# EAGLE design pci-e_x1-breakout (EAGLE 6.6.0)
CNAME: http://ch.ege.io; CREVISION: 1.0; DESIGNER: Christian Ege
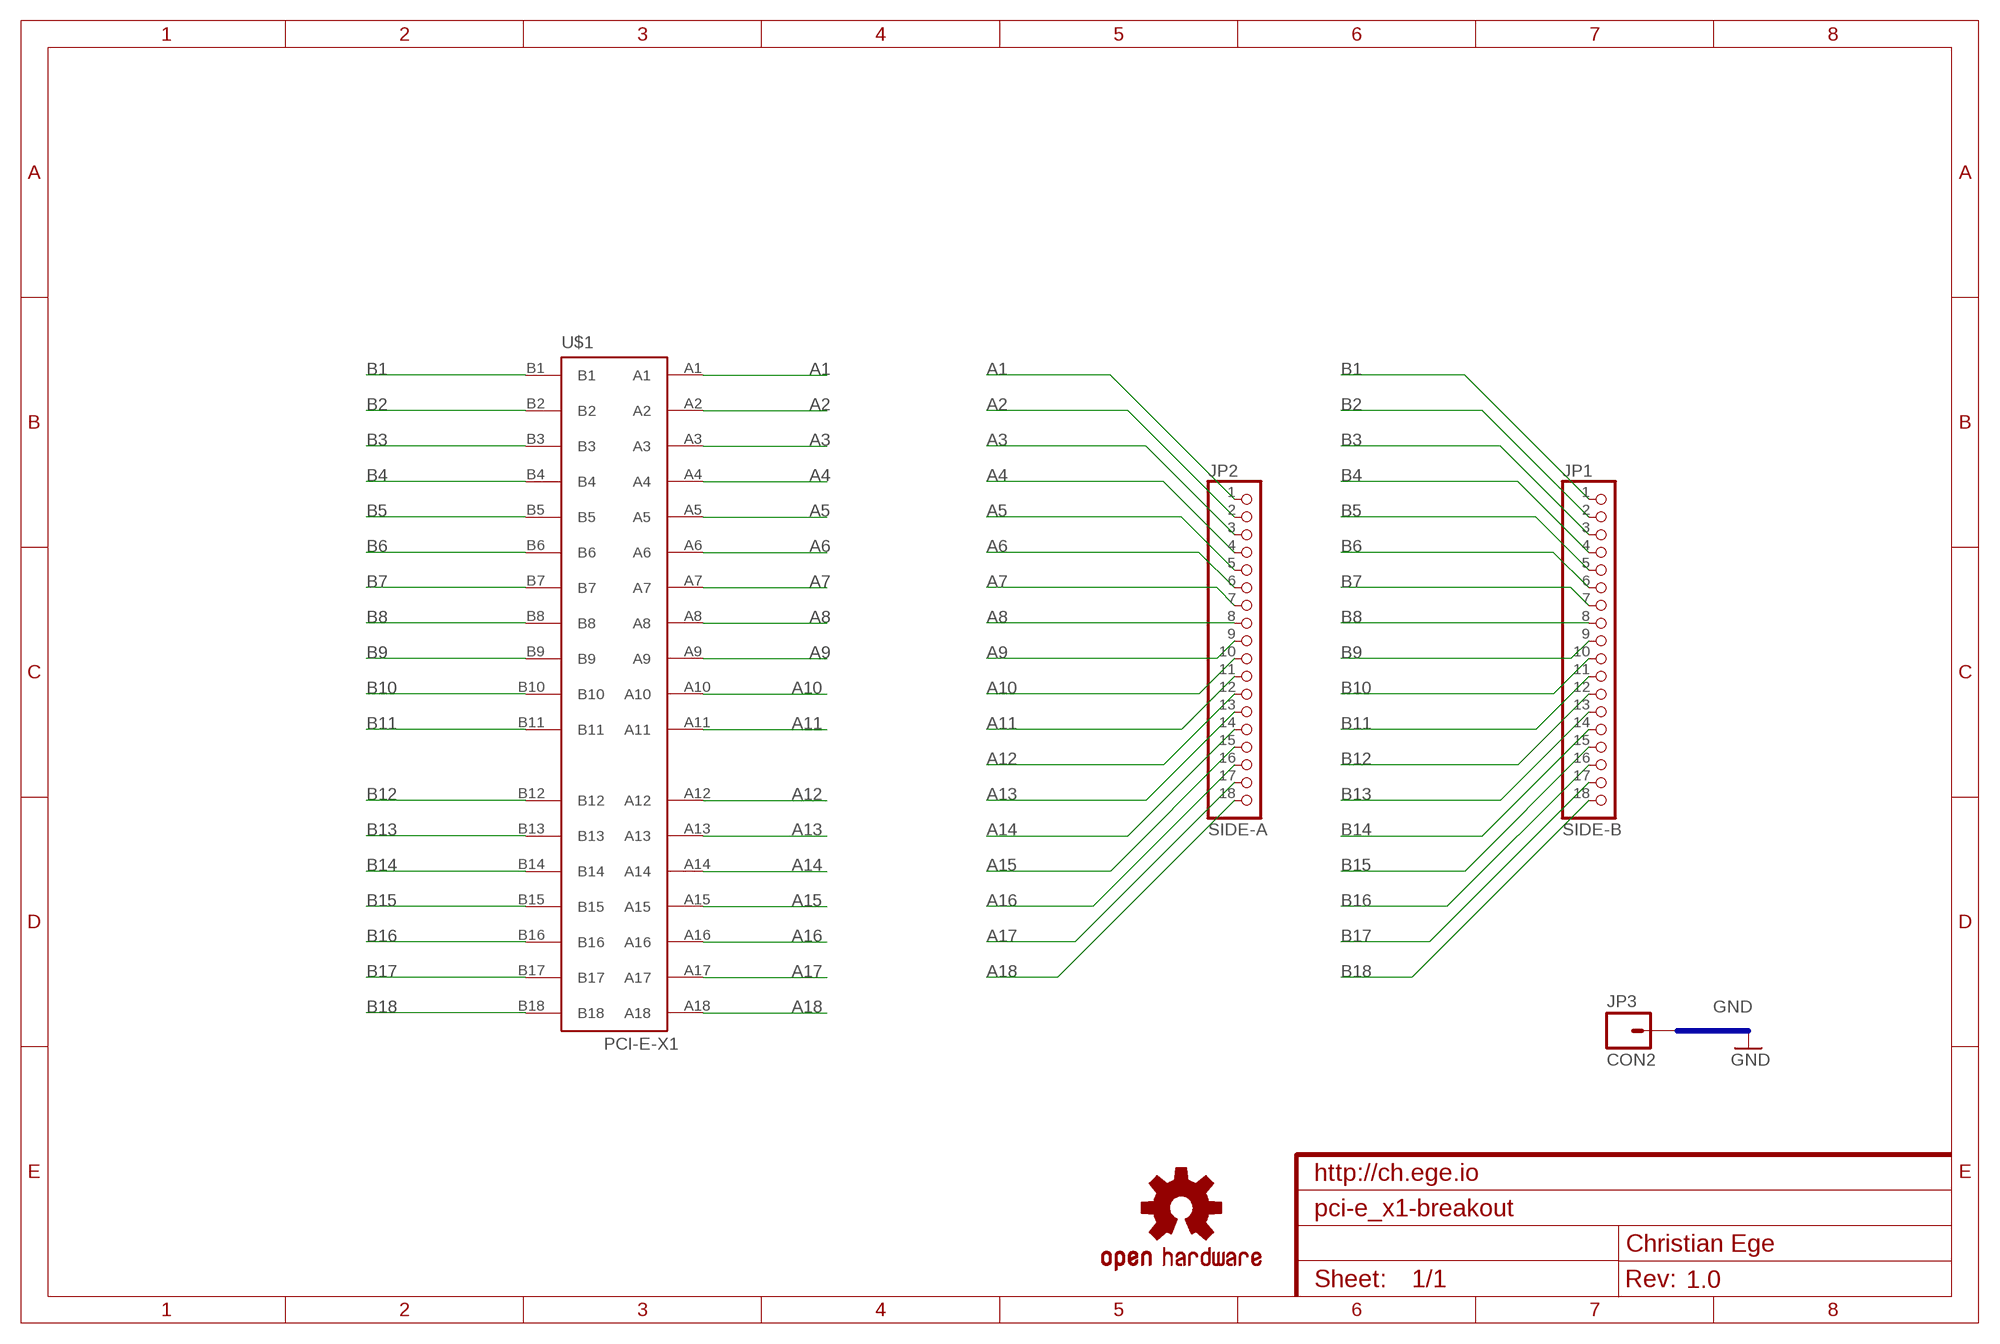
[diagram p0: schematic, sheet 1]

## Parts
JP1  SIDE-B  PINHD-1X18  [1X18]
JP2  SIDE-A  PINHD-1X18  [1X18]
JP3  CON2  M01PTH  [1X01]
LOGO1  OSHW-LOGOS  [OSHW-LOGO-S]
U$1  PCI-E-X1  [PCI-E-X1]

## Nets
A1: JP2.1 U$1.A1
A2: JP2.2 U$1.A2
A3: JP2.3 U$1.A3
A4: JP2.4 U$1.A4
A5: JP2.5 U$1.A5
A6: JP2.6 U$1.A6
A7: JP2.7 U$1.A7
A8: JP2.8 U$1.A8
A9: JP2.9 U$1.A9
A10: JP2.10 U$1.A10
A11: JP2.11 U$1.A11
A12: JP2.12 U$1.A12
A13: JP2.13 U$1.A13
A14: JP2.14 U$1.A14
A15: JP2.15 U$1.A15
A16: JP2.16 U$1.A16
A17: JP2.17 U$1.A17
A18: JP2.18 U$1.A18
B1: JP1.1 U$1.B1
B2: JP1.2 U$1.B2
B3: JP1.3 U$1.B3
B4: JP1.4 U$1.B4
B5: JP1.5 U$1.B5
B6: JP1.6 U$1.B6
B7: JP1.7 U$1.B7
B8: JP1.8 U$1.B8
B9: JP1.9 U$1.B9
B10: JP1.10 U$1.B10
B11: JP1.11 U$1.B11
B12: JP1.12 U$1.B12
B13: JP1.13 U$1.B13
B14: JP1.14 U$1.B14
B15: JP1.15 U$1.B15
B16: JP1.16 U$1.B16
B17: JP1.17 U$1.B17
B18: JP1.18 U$1.B18
Unconnected: JP3.1

## Buses
GND

## Library data of the parts
JP1 JP2 = pinhead:PINHD-1X18: PIN HEADER
JP3 = SparkFun-Connectors:M01: Header 1 Standard 1-pin 0.1" header. Use with straight break away headers (SKU : PRT-00116), right angle break away headers (PRT-00553), swiss pins (PRT-00743), machine pins (PRT-00117), and female headers (PRT-00115).
LOGO1 = SparkFun-Aesthetics:OSHW-LOGO: Open Source Hardware Logo This logo indicates the piece of hardware it is found on incorporates a OSHW license and/or adheres to the definition of open source hardware found here: http://freedomdefined.org/OSHW
U$1 = pci-e_x1:PCI-E-X1

## Board
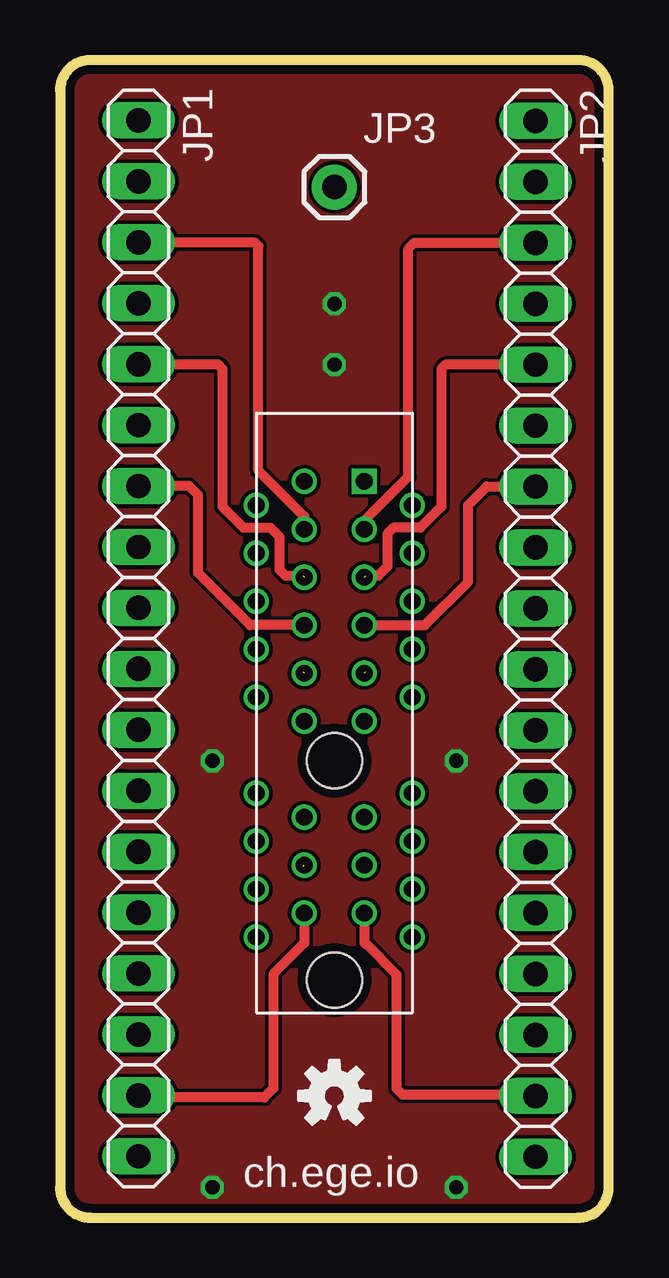
[diagram p1: board, top side]
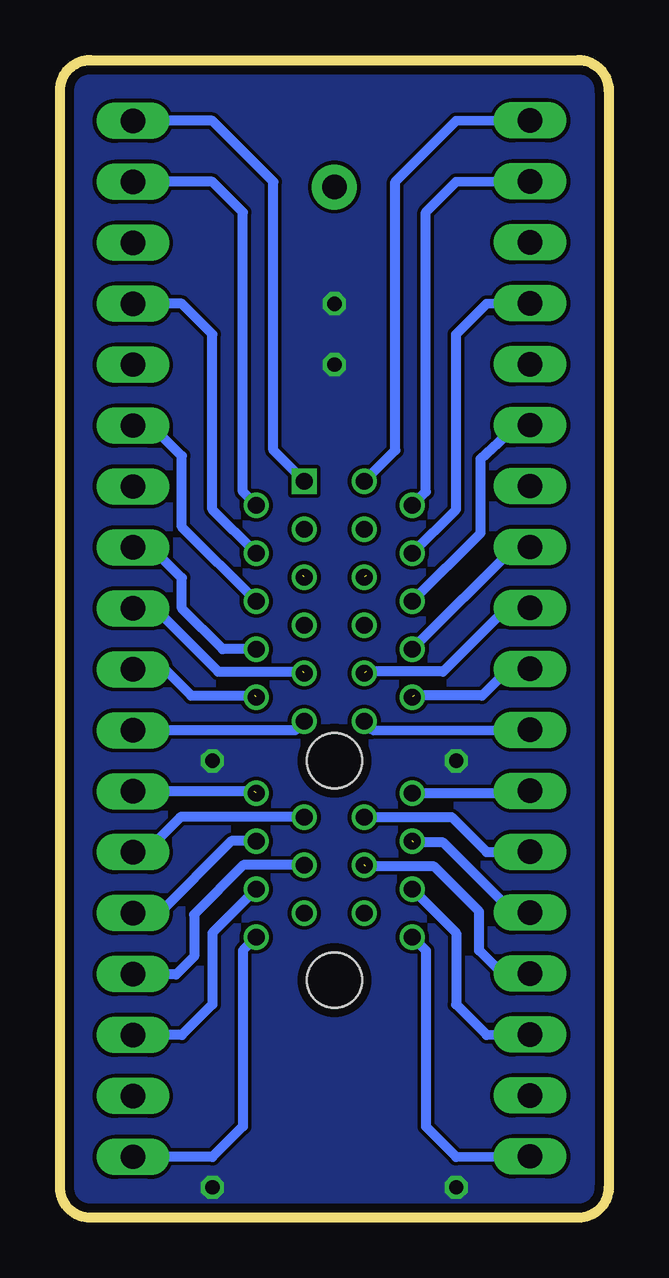
[diagram p2: board, bottom side, seen from below]

Size 22.86 x 48.26 mm. Coordinates in mm from the lower left corner, seen from the top.
Outline: 0,46.99 0,1.27 arc90 1.27,0 21.59,0 arc90 22.86,1.27 22.86,46.99 arc90 21.59,48.26 1.27,48.26 arc90 0,46.99
Copper layers (1*16): Top 0.0356mm / dielectric 1.5011mm / Bottom 0.0356mm
Design rules "OSHPark_LaenPCBOrder": minimum track width 6mil, minimum drill 13mil, track to track 6mil, track to pad 6mil, pad to pad 6mil, via to via 6mil, smd to smd 6mil, copper to edge 15mil, drill to drill 6mil, minimum pad ring 7mil, minimum via ring 7mil, stop-mask expansion 3mil, vias tented up to drill 0mil, thermal gap 10mil

### Footprints (pad centres in the part's own frame; a part is rotated, then mirrored left to right if it is on the bottom)
1X18 = drill 1.016 long: 1 -21.59,0; 2 -19.05,0; 3 -16.51,0; 4 -13.97,0; 5 -11.43,0; 6 -8.89,0; 7 -6.35,0; 8 -3.81,0; 9 -1.27,0; 10 1.27,0; 11 3.81,0; 12 6.35,0; 13 8.89,0; 14 11.43,0; 15 13.97,0; 16 16.51,0; 17 19.05,0; 18 21.59,0
1X01 = drill 1.016 pad 1.88: 1 0,0
PCI-E-X1 = drill 0.7 square: A1 1.25,11.65 | drill 0.7: A2 3.25,10.65; A3 1.25,9.65; A4 3.25,8.65; A5 1.25,7.65; A6 3.25,6.65; A7 1.25,5.65; A8 3.25,4.65; A9 1.25,3.65; A10 3.25,2.65; A11 1.25,1.65; A12 3.25,-1.35; A13 1.25,-2.35; A14 3.25,-3.35; A15 1.25,-4.35; A16 3.25,-5.35; A17 1.25,-6.35; A18 3.25,-7.35; B1 -1.25,11.65; B2 -3.25,10.65; B3 -1.25,9.65; B4 -3.25,8.65; B5 -1.25,7.65; B6 -3.25,6.65; B7 -1.25,5.65; B8 -3.25,4.65; B9 -1.25,3.65; B10 -3.25,2.65; B11 -1.25,1.65; B12 -3.25,-1.35; B13 -1.25,-2.35; B14 -3.25,-3.35; B15 -1.25,-4.35; B16 -3.25,-5.35; B17 -1.25,-6.35; B18 -3.25,-7.35 | hole 2.3: 0,0; 0,-9.15

### Placement (x,y rotation side)
JP1  3.27,24.15 270 top
JP2  19.82,24.13 270 top
JP3  11.43,42.97 0 top
LOGO1  11.43,5.08 0 top
U$1  11.43,19.05 0 top

### Tracks (layer width: path | path; a pad name or v marks a point on that pad's centre or on a via)
A1
  Bottom 0.406: JP2.1 16.51,45.72 13.97,43.18 13.97,31.99 U$1.A1
A2
  Bottom 0.406: JP2.2 16.51,43.18 15.24,41.91 15.24,30.26 U$1.A2
A3
  Top 0.406: JP2.3 14.77,40.65 14.52,40.4 14.52,30.89 12.77,29.14 12.68,29.05 U$1.A3
A4
  Bottom 0.406: JP2.4 17.78,38.1 16.51,36.83 16.51,29.53 U$1.A4
A5  (1 unrouted)
  Top 0.406: JP2.5 16.06,35.56 15.89,35.4 15.89,29.64 15.02,28.77 13.89,28.77 13.64,28.52 13.64,27.14 13.27,26.77 12.75,26.77
A6
  Bottom 0.406: JP2.6 19.05,33.02 17.78,31.75 17.78,28.8 U$1.A6
A7
  Top 0.406: U$1.A7 15.2,24.7 17,26.5 17,29.7 17.78,30.48 JP2.7
A8
  Bottom 0.406: U$1.A8 16.08,23.7 17.78,25.4 17.78,26.67 19.05,27.94 JP2.8
A9  (1 unrouted)
  Bottom 0.406: JP2.9 18.9,25.4 16.27,22.77 12.75,22.77
A10  (1 unrouted)
  Bottom 0.406: JP2.10 18.55,22.86 18.52,22.89 17.39,21.77 14.75,21.77
A11
  Bottom 0.406: JP2.11 13.06,20.32 U$1.A11
A12  (1 unrouted)
  Bottom 0.406: 14.76,17.78 JP2.12
A13
  Bottom 0.406: JP2.13 20.29,15.27 19.27,15.27 17.91,16.64 17.84,16.7 U$1.A13
A14
  Bottom 0.406: JP2.14 19.77,12.64 18.77,12.64 15.71,15.7 U$1.A14
A15
  Bottom 0.406: JP2.15 19.8,10.14 18.02,10.14 17.27,10.89 17.27,12.64 15.21,14.7 U$1.A15
A16
  Bottom 0.406: JP2.16 17.78,7.62 16.51,8.89 16.51,11.87 U$1.A16
A17
  Top 0.406: JP2.17 19.75,5.14 14.27,5.14 14.02,5.39 14.02,10.14 12.73,11.43 12.7,11.43 12.68,11.45 U$1.A17
A18
  Bottom 0.406: JP2.18 16.51,2.54 15.24,3.81 15.24,11.14 U$1.A18
B1
  Bottom 0.406: JP1.1 6.35,45.72 8.89,43.18 8.89,31.99 U$1.B1
B2
  Bottom 0.406: JP1.2 6.35,43.18 7.62,41.91 7.62,30.26 U$1.B2
B3
  Top 0.406: JP1.3 3.29,40.65 8.14,40.65 8.27,40.52 8.27,31.14 10.18,29.23 U$1.B3
B4
  Bottom 0.406: JP1.4 5.08,38.1 6.35,36.83 6.35,29.53 U$1.B4
B5  (1 unrouted)
  Top 0.406: JP1.5 6.58,35.58 6.77,35.4 6.77,29.64 7.64,28.77 8.77,28.77 9.14,28.39 9.14,27.02 9.39,26.77 10.11,26.77
B6
  Bottom 0.406: JP1.6 3.81,33.02 5.33,31.62 5.33,28.55 U$1.B6
B7
  Top 0.406: U$1.B7 7.92,24.7 5.75,26.88 5.75,30.12 5.38,30.5 JP1.7
B8
  Bottom 0.406: JP1.8 3.94,27.94 U$1.B8
B9  (1 unrouted)
  Bottom 0.406: JP1.9 4.25,25.42 6.89,22.77 10.11,22.77
B10  (1 unrouted)
  Bottom 0.406: JP1.10 4.16,22.88 5.27,21.77 8.11,21.77
B11
  Bottom 0.406: JP1.11 9.8,20.32 U$1.B11
B12
  Bottom 0.406: U$1.B12 3.37,17.7 JP1.12
B13
  Bottom 0.406: JP1.13 3.29,15.24 5.08,15.24 6.54,16.7 U$1.B13
B14  (1 unrouted)
  Bottom 0.406: JP1.14 3.97,12.72 6.89,15.64 8.12,15.64
B15  (1 unrouted)
  Bottom 0.406: JP1.15 4.43,10.18 5.39,11.14 5.39,12.77 7.27,14.64 10.12,14.64
B16
  Bottom 0.406: JP1.16 5.08,7.62 6.35,8.89 6.35,11.87 U$1.B16
B17
  Top 0.406: JP1.17 3.35,5.02 8.52,5.02 8.89,5.39 8.89,10.16 10.18,11.45 U$1.B17
B18
  Bottom 0.406: JP1.18 6.35,2.54 7.62,3.81 7.62,11.14 U$1.B18
GND  (via drill 0.6)
  other vias: 6.35,1.27 16.51,1.27 16.51,19.05 6.35,19.05 11.43,35.56 11.43,38.1
  pour Top: 0,48.26 0,0 22.86,0 22.86,48.26
  pour Bottom: 0,48.26 0,0 22.86,0 22.86,48.26

### Text on the board
tNames: ch.ege.io